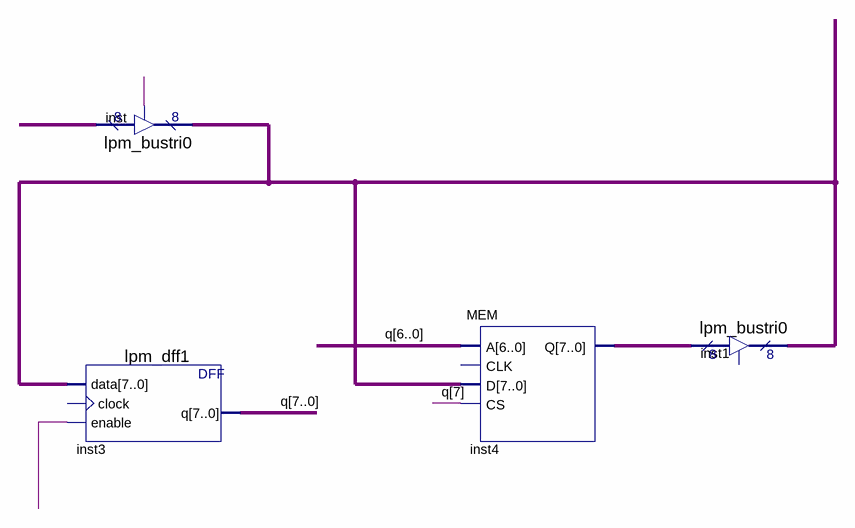
[diagram p0: schematic sheet]
// Quartus schematic BUS.bdf as structural Verilog: 4 symbols, 0 pins
module BUS (
);

  wire undriven_2, undriven_3;
  wire [7:0] inst4_q, inst_tridata, q, undriven;

  lpm_bustri0 inst (.enabledt(undriven_2), .data(undriven), .tridata(inst_tridata));
  lpm_dff1 inst3 (.data(inst_tridata), .enable(undriven_3), .q(q));  // open: clock
  MEM inst4 (.A(q[6:0]), .D(inst_tridata), .CS(q[7]), .Q(inst4_q));  // open: CLK
  lpm_bustri0 inst1 (.data(inst4_q), .tridata(inst_tridata));  // open: enabledt
endmodule
